# EAGLE design RoboWatch V1 Arduino (EAGLE 9.6.2)
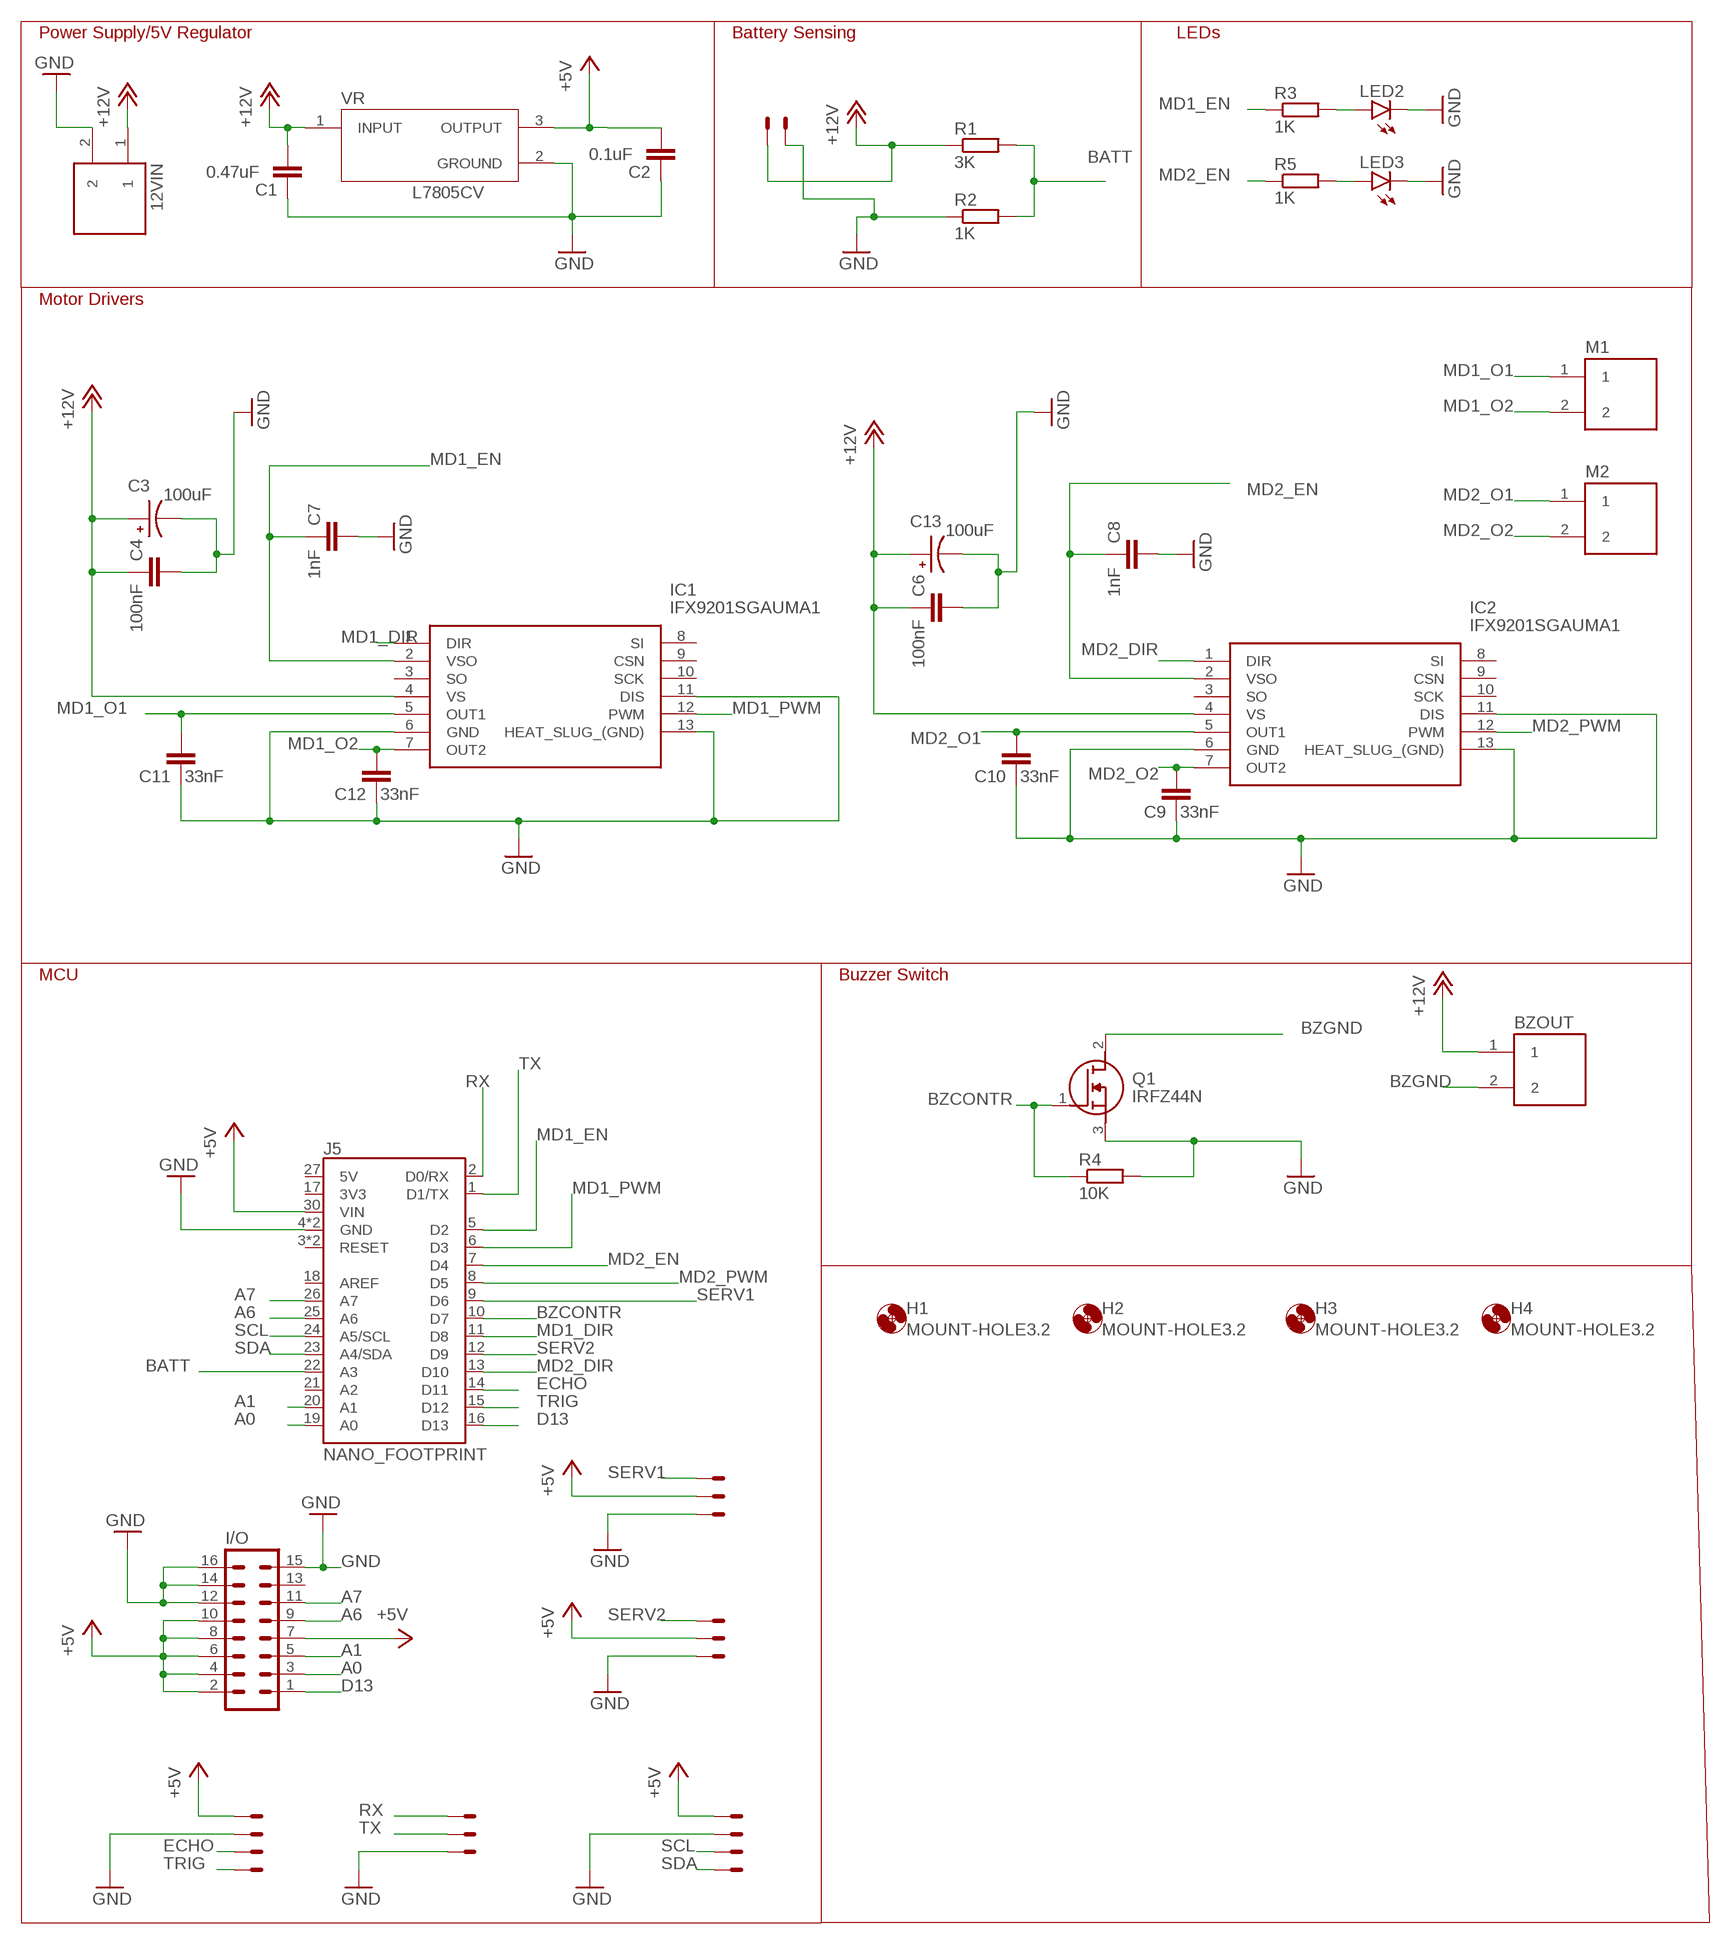
[diagram p0: schematic, sheet 1]

## Parts
12VIN  KF301-2P  [HANDSON_KF301-2P]
BZOUT  KF301-2P  [HANDSON_KF301-2P]
C1  0.47uF  C-EUC0603  [C0603]
C2  0.1uF  C-EUC0603  [C0603]
C3  100uF  EEEFN1E101UP  [CAP_EEEFN1E101UP]
C4  100nF  C-EUC0603  [C0603]
C6  100nF  C-EUC0603  [C0603]
C7  1nF  C-EUC0603  [C0603]
C8  1nF  C-EUC0603  [C0603]
C9  33nF  C-EUC0603  [C0603]
C10  33nF  C-EUC0603  [C0603]
C11  33nF  C-EUC0603  [C0603]
C12  33nF  C-EUC0603  [C0603]
C13  100uF  EEEFN1E101UP  [CAP_EEEFN1E101UP]
H1  MOUNT-HOLE3.2  [3,2]
H2  MOUNT-HOLE3.2  [3,2]
H3  MOUNT-HOLE3.2  [3,2]
H4  MOUNT-HOLE3.2  [3,2]
I2C  22-23-2041  [22-23-2041]
I/O  MA08-2  [MA08-2]
IC1  IFX9201SGAUMA1  [PG-DSO-12-17]
IC2  IFX9201SGAUMA1  [PG-DSO-12-17]
J5  NANO_FOOTPRINT  [NANO]
LED2  LEDCHIPLED_0805  [CHIPLED_0805]
LED3  LEDCHIPLED_0805  [CHIPLED_0805]
M1  KF301-2P  [HANDSON_KF301-2P]
M2  KF301-2P  [HANDSON_KF301-2P]
Q1  IRFZ44N  [TO254P440X1000X1900-3P]
R1  3K  R-EU_R0603  [R0603]
R2  1K  R-EU_R0603  [R0603]
R3  1K  R-EU_R0603  [R0603]
R4  10K  R-EU_R0603  [R0603]
R5  1K  R-EU_R0603  [R0603]
RX/TX  22-23-2031  [22-23-2031]
S1  22-23-2031  [22-23-2031]
S2  22-23-2031  [22-23-2031]
US  22-23-2041  [22-23-2041]
VR  L7805CV  [TO255P1040X460X1968-3]
X4  22-23-2021  [22-23-2021]

## Nets
+5V: C2.2 I2C.1 I/O.2 I/O.4 I/O.6 I/O.7 I/O.8 I/O.10 J5.30(VIN) S1.2 S2.2 US.1 VR.3(OUTPUT)
+12V: 12VIN.1 BZOUT.1 C1.2 C3.1 C4.1 C6.1 C13.1 IC1.4(VS) IC2.4(VS) R1.1 VR.1(INPUT) X4.1
A0: I/O.3 J5.19(A0)
A1: I/O.5 J5.20(A1)
A6: I/O.9 J5.25(A6)
A7: I/O.11 J5.26(A7)
BATT: J5.22(A3) R1.2 R2.2
BZCONTR: J5.10(D7) Q1.1(G) R4.1
BZGND: BZOUT.2 Q1.2(D)
D13: I/O.1 J5.16(D13)
ECHO: J5.14(D11) US.3
GND: 12VIN.2 C1.1 C2.1 C3.2 C4.2 C6.2 C7.2 C8.2 C9.1 C10.1 C11.1 C12.1 C13.2 I2C.2 I/O.12 I/O.14 I/O.15 I/O.16 IC1.6(GND) IC1.11(DIS) IC1.13(HEAT_SLUG_(GND)) IC2.6(GND) IC2.11(DIS) IC2.13(HEAT_SLUG_(GND)) J5.4(GND) J5.29(GND) LED2.C LED3.C Q1.3(S) R2.1 R4.2 RX/TX.3 S1.3 S2.3 US.2 VR.2(GROUND) X4.2
MD1_DIR: IC1.1(DIR) J5.11(D8)
MD1_EN: C7.1 IC1.2(VSO) J5.5(D2) R3.1
MD1_O1: C11.2 IC1.5(OUT1) M1.1
MD1_O2: C12.2 IC1.7(OUT2) M1.2
MD1_PWM: IC1.12(PWM) J5.6(D3)
MD2_DIR: IC2.1(DIR) J5.13(D10)
MD2_EN: C8.1 IC2.2(VSO) J5.7(D4) R5.1
MD2_O1: C10.2 IC2.5(OUT1) M2.1
MD2_O2: C9.2 IC2.7(OUT2) M2.2
MD2_PWM: IC2.12(PWM) J5.8(D5)
N$1: LED2.A R3.2
N$2: LED3.A R5.2
RX: J5.2(D0/RX) RX/TX.1
SCL: I2C.3 J5.24(A5/SCL)
SDA: I2C.4 J5.23(A4/SDA)
SERV1: J5.9(D6) S1.1
SERV2: J5.12(D9) S2.1
TRIG: J5.15(D12) US.4
TX: J5.1(D1/TX) RX/TX.2
Unconnected: I/O.13 IC1.3(SO) IC1.8(SI) IC1.9(CSN) IC1.10(SCK) IC2.3(SO) IC2.8(SI) IC2.9(CSN) IC2.10(SCK) J5.3(RESET) J5.17(3V3) J5.18(AREF) J5.21(A2) J5.27(5V) J5.28(RESET)

## Notes on the sheet
- Power Supply/5V Regulator | Battery Sensing | LEDs
- Motor Drivers
- MCU | Buzzer Switch

## Library data of the parts
12VIN BZOUT M1 M2 = KF301-2P:KF301-2P: 2 Pin Terminal Block 5mm Pitch Check availability <https://pricing.snapeda.com/parts/KF301-2P/Handson%20Technology/view-part?ref=eda>; AVAILABILITY: Not in stock; DESCRIPTION: 2 Pin Terminal Block 5mm Pitch; MF: Handson Technology; MP: KF301-2P; PACKAGE: None; PRICE: None
C1 C2 C4 C6-C12 = rcl:C-EU: CAPACITOR, European symbol; SPICEPREFIX: C
C3 C13 = Capstone_CAP:EEEFN1E101UP: Check availability <https://pricing.snapeda.com/parts/EEEFN1E101UP/Panasonic/view-part?ref=eda>; AVAILABILITY: In Stock; DESCRIPTION: CAP ALUM 100UF 20% 25V SMD; MF: Panasonic; MP: EEEFN1E101UP; PACKAGE: RADIAL-2 Panasonic; PRICE: None; PURCHASE-URL: https://pricing.snapeda.com/search?q=EEEFN1E101UP&ref=eda
H1-H4 = holes:MOUNT-HOLE: MOUNTING HOLE with drill center marker
I2C US = con-molex:22-23-2041: .100" (2.54mm) Center Header - 4 Pin; MF: MOLEX; MPN: 22-23-2041; OC_FARNELL: 1462920; OC_NEWARK: 38C0355
I/O = con-lstb:MA08-2: PIN HEADER; OC_FARNELL: unknown; OC_NEWARK: unknown
IC1 IC2 = IFX9201SGAUMA1:IFX9201SGAUMA1: INFINEON - IFX9201SGAUMA1 - MOTOR CONTROLLER, HALF BRIDGE, SOIC-12 Source: Datasheet <https://www.infineon.com/dgdl/Infineon-IFX9201SG-DS-v01_01-EN.pdf?fileId=5546d4624cb7f111014d2e8916795dea>; ARROW_PART_NUMBER: IFX9201SGAUMA1; ARROW_PRICE-STOCK: https://www.arrow.com/en/products/ifx9201sgauma1/infineon-technologies-ag?region=nac; DESCRIPTION: INFINEON - IFX9201SGAUMA1 - MOTOR CONTROLLER, HALF BRIDGE, SOIC-12; HEIGHT: 2.6mm; MANUFACTURER_NAME: Infineon; MANUFACTURER_PART_NUMBER: IFX9201SGAUMA1; MOUSER_PART_NUMBER: 726-IFX9201SGAUMA1; MOUSER_PRICE-STOCK: https://www.mouser.co.uk/ProductDetail/Infineon-Technologies/IFX9201SGAUMA1?qs=CVaTMblcXggE9XQ1VnAvKA%3D%3D
J5 = SparkFun-Boards:NANO_FOOTPRINT: Generic Nano Footprint
LED2 LED3 = led:LED: LED OSRAM: - CHIPLED LG R971, LG N971, LY N971, LG Q971, LY Q971, LO R971, LY R971 LH N974, LH R974 LS Q976, LO Q976, LY Q976 LO Q996 - Hyper CHIPLED LW Q18S LB Q993, LB Q99A, LB R99A - SideLED LS A670, LO A670, LY A670, LG A670, LP A670 LB A673, LV A673, LT A673, LW A673 LH A674 LY A675 LS A676, LA A676, LO A676, LY A676, LW A676 LS A679, LY A679, LG A679 - Hyper Micro SIDELED® LS Y876, LA Y876, LO Y876, LY Y876 LT Y87S - SmartLED LW L88C, LW L88S LB L89C, LB L89S, LG L890 LS L89K, LO L89K, LY L89K LS L896, LA L896, LO L896, LY L896 - TOPLED LS T670, LO T670, LY T670, LG T670, LP T670 LSG T670, LSP T670, LSY T670, LOP T670, LYG T670 LG T671, LOG T671, LSG T671 LB T673, LV T673, LT T673, LW T673 LH T674 LS T676, LA T676, LO T676, LY T676, LB T676, LH T676, LSB T676, LW T676 LB T67C, LV T67C, LT T67C, LS T67K, LO T67K, LY T67K, LW E67C LS E67B, LA E67B, LO E67B, LY E67B, LB E67C, LV E67C, LT E67C LW T67C LS T679, LY T679, LG T679 LS T770, LO T770, LY T770, LG T770, LP T770 LB T773, LV T773, LT T773, LW T773 LH T774 LS E675, LA E675, LY E675, LS T675 LS T776, LA T776, LO T776, LY T776, LB T776 LHGB T686 LT T68C, LB T68C - Hyper Mini TOPLED® LB M676 - Mini TOPLED Santana® LG M470 LS M47K, LO M47K, LY M47K Source: http://www.osram.convergy.de LUXEON: - LUMILED® LXK2-PW12-R00, LXK2-PW12-S00, LXK2-PW14-U00, LXK2-PW14-V00 LXK2-PM12-R00, LXK2-PM12-S00, LXK2-PM14-U00 LXK2-PE12-Q00, LXK2-PE12-R00, LXK2-PE12-S00, LXK2-PE14-T00, LXK2-PE14-U00 LXK2-PB12-K00, LXK2-PB12-L00, LXK2-PB12-M00, LXK2-PB14-N00, LXK2-PB14-P00, LXK2-PB14-Q00 LXK2-PR12-L00, LXK2-PR12-M00, LXK2-PR14-Q00, LXK2-PR14-R00 LXK2-PD12-Q00, LXK2-PD12-R00, LXK2-PD12-S00 LXK2-PH12-R00, LXK2-PH12-S00 LXK2-PL12-P00, LXK2-PL12-Q00, LXK2-PL12-R00 Source: www.luxeon.com KINGBRIGHT: KA-3528ASYC Source: www.kingbright.com
Q1 = CS_IRFZ44N:IRFZ44N: isc N-Channel MOSFET Transistor Source: Datasheet <https://4donline.ihs.com/images/VipMasterIC/IC/INSE/INSES02201/INSES02201-1.pdf?hkey=EF798316E3902B6ED9A73243A3159BB0>; DESCRIPTION: isc N-Channel MOSFET Transistor; HEIGHT: 4.4mm; MANUFACTURER_NAME: Inchange Semiconductor; MANUFACTURER_PART_NUMBER: IRFZ44N
R1-R5 = rcl:R-EU_: RESISTOR, European symbol; SPICEPREFIX: R
RX/TX S1 S2 = con-molex:22-23-2031: .100" (2.54mm) Center Header - 3 Pin; MF: MOLEX; MPN: 22-23-2031; OC_FARNELL: 1462950; OC_NEWARK: 30C0862
VR = Capstone_L7805CV:L7805CV: Standard Regulator Pos 5V 1.5A 3-Pin(3+Tab) TO-220 Standard Regulator Pos 5V 1.5A 3-Pin(3+Tab) TO-220 Check availability <https://pricing.snapeda.com/parts/L7805CV/STMicroelectronics/view-part?ref=eda>; AVAILABILITY: In Stock; DESCRIPTION: Linear Voltage Regulator IC Positive Fixed 1 Output 1.5A TO-220; MF: STMicroelectronics; MP: L7805CV; PACKAGE: TO-220-3 STMicroelectronics; PRICE: None; PURCHASE-URL: https://pricing.snapeda.com/search?q=L7805CV&ref=eda
X4 = con-molex:22-23-2021: .100" (2.54mm) Center Header - 2 Pin; MF: MOLEX; MPN: 22-23-2021; OC_FARNELL: 1462926; OC_NEWARK: 25C3832

## Board
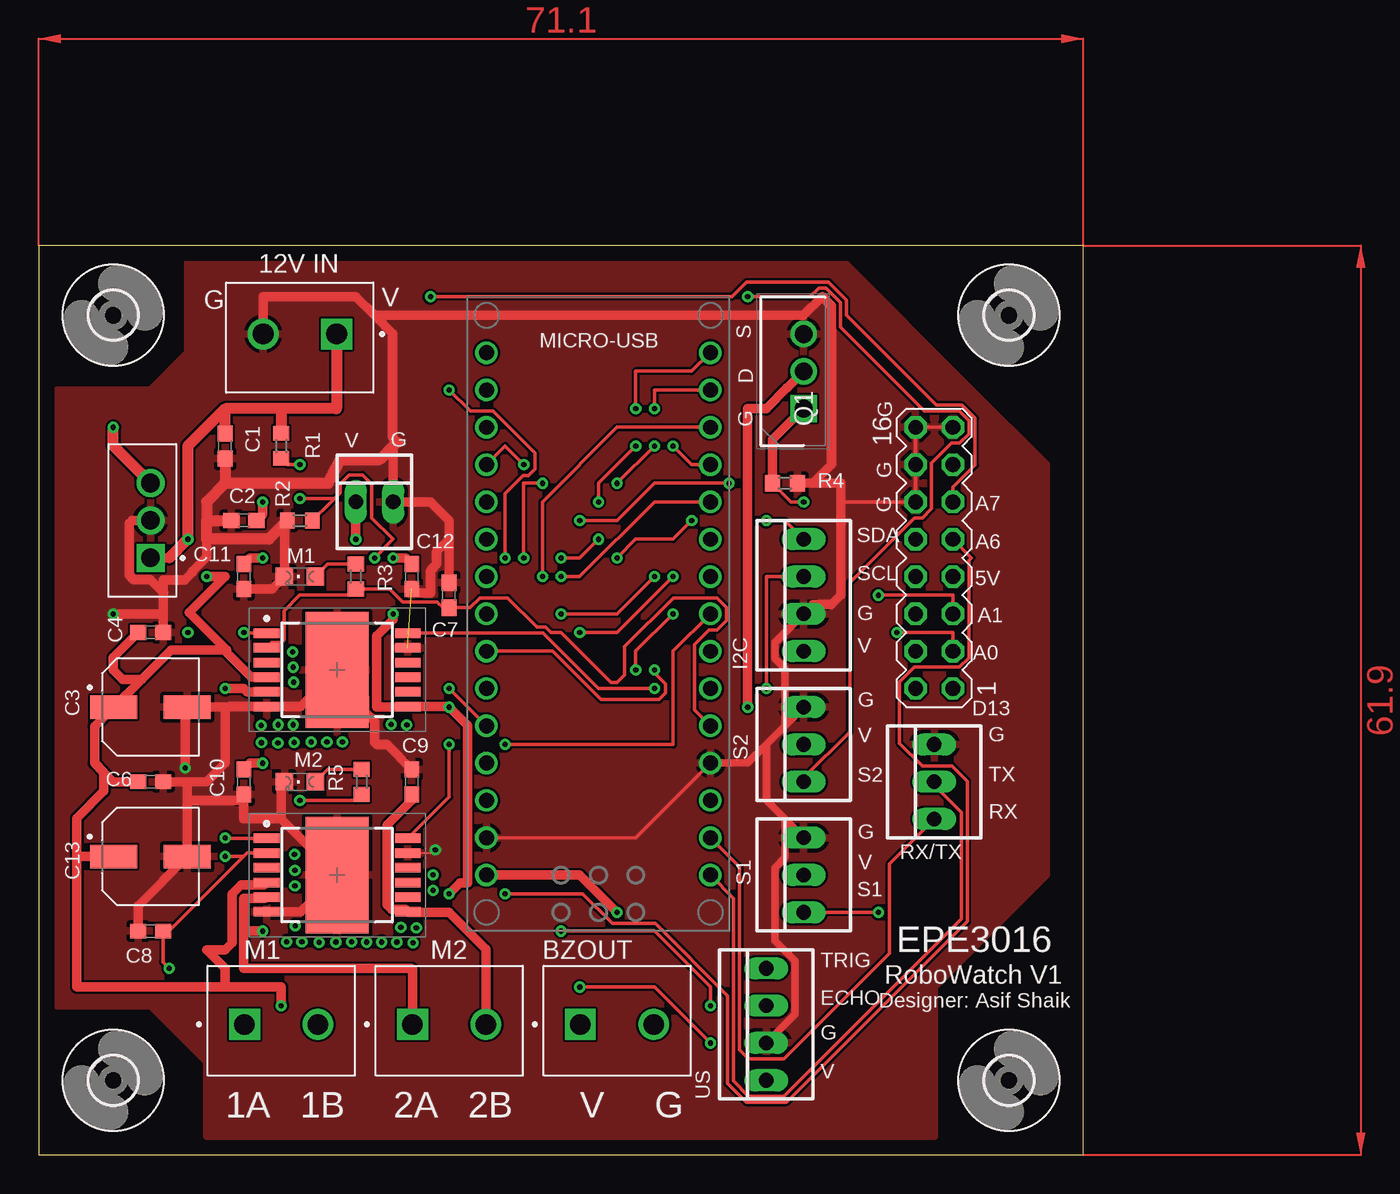
[diagram p1: board, top side]
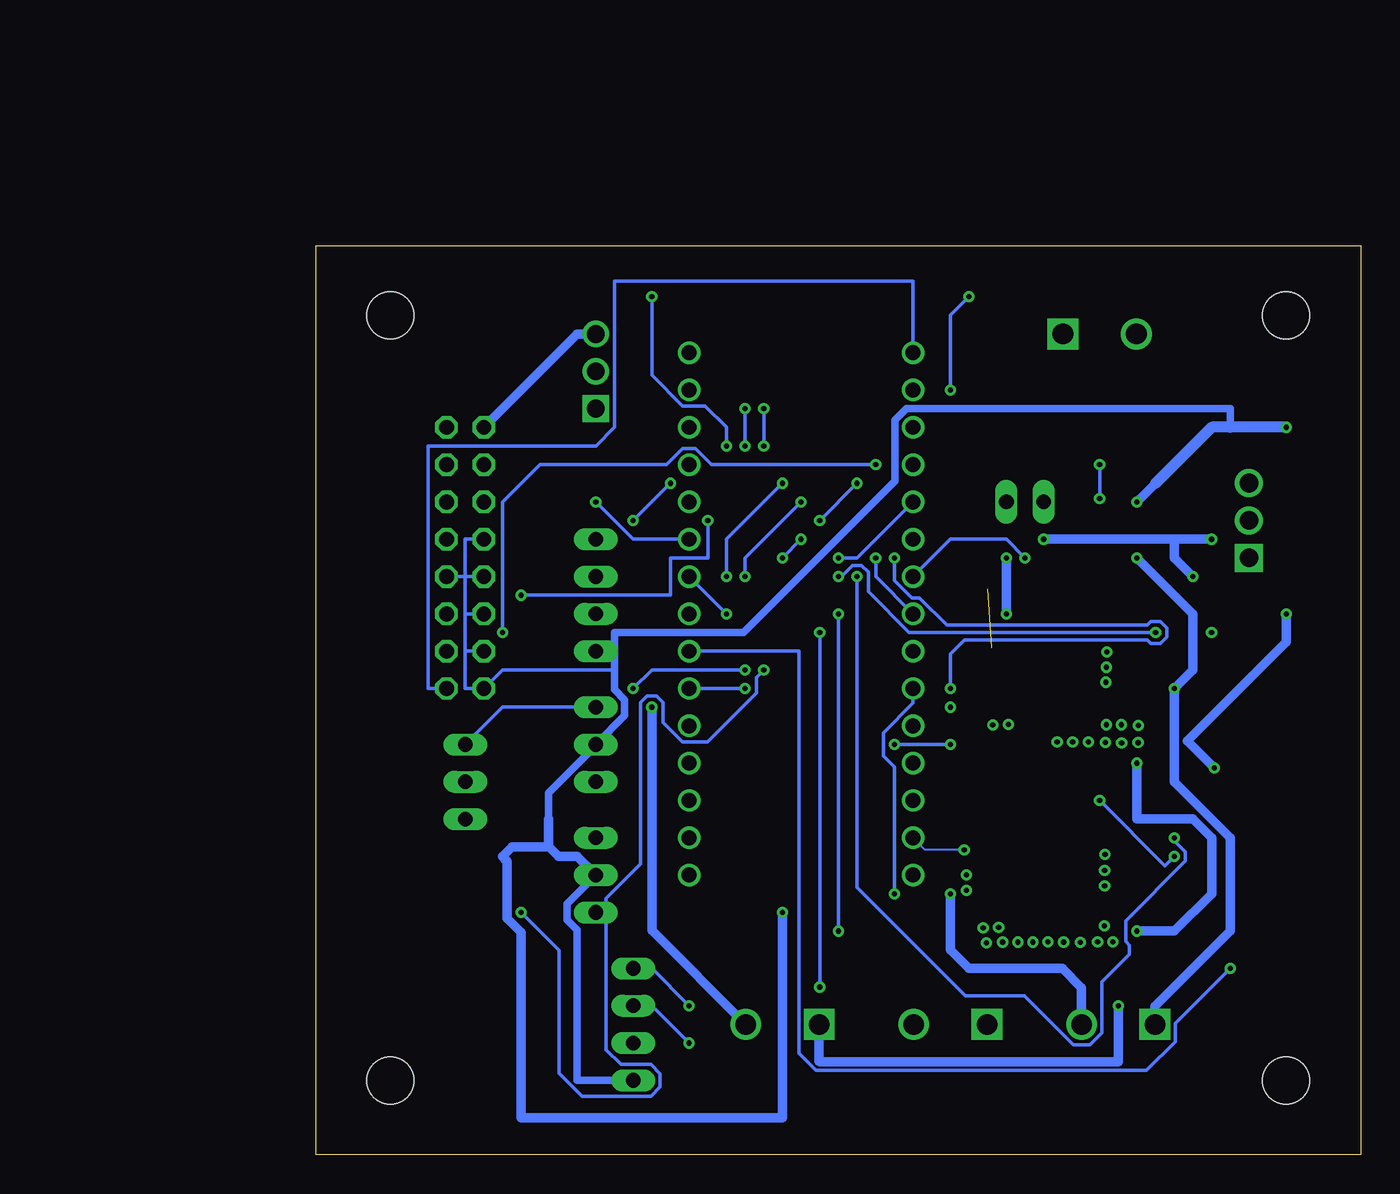
[diagram p2: board, bottom side, seen from below]

Size 71.1 x 61.9 mm. Coordinates in mm from the lower left corner, seen from the top.
Outline: 0,0 71.1,0 71.1,61.9 0,61.9 0,0
Copper layers (1*16): Top 0.035mm / dielectric 1.5mm / Bottom 0.035mm
Design rules "default *": minimum track width 6mil, minimum drill 0.35mm, track to track 6mil, track to pad 0.2mm, pad to pad 6mil, via to via 10mil, smd to smd 6mil, copper to edge 40mil, drill to drill 6mil, minimum pad ring 10mil, minimum via ring 8mil, stop-mask expansion 4mil, vias tented up to drill 0mil, thermal gap 10mil

### Footprints (pad centres in the part's own frame; a part is rotated, then mirrored left to right if it is on the bottom)
HANDSON_KF301-2P = drill 1.4 square: 1 -2.5,0 | drill 1.4: 2 2.5,0
C0603 = smd 1.1 x 1: 1 -0.85,0; 2 0.85,0
CAP_EEEFN1E101UP = smd 3.2 x 1.6: 1 -2.5,0; 2 2.5,0
3,2 = hole 3.2: 0,0
22-23-2041 = drill 1 long: 1 -3.81,0; 2 -1.27,0; 3 1.27,0; 4 3.81,0
MA08-2 = drill 1.016 octagon: 1 -8.89,-1.27; 2 -8.89,1.27; 3 -6.35,-1.27; 4 -6.35,1.27; 5 -3.81,-1.27; 6 -3.81,1.27; 7 -1.27,-1.27; 8 -1.27,1.27; 9 1.27,-1.27; 10 1.27,1.27; 11 3.81,-1.27; 12 3.81,1.27; 13 6.35,-1.27; 14 6.35,1.27; 15 8.89,-1.27; 16 8.89,1.27
PG-DSO-12-17 = smd 1.75 x 0.65: 1 -4.8,2.5; 2 -4.8,1.5; 3 -4.8,0.5; 4 -4.8,-0.5; 5 -4.8,-1.5; 6 -4.8,-2.5; 7 4.8,-2.5; 8 4.8,-1.5; 9 4.8,-0.5; 10 4.8,0.5; 11 4.8,1.5; 12 4.8,2.5 | smd 4.3 x 7.9: 13 0,0
NANO = drill 1.016: 1 -7.62,17.78; 2 -7.62,15.24; 3 -7.62,12.7; 4 -7.62,10.16; 5 -7.62,7.62; 6 -7.62,5.08; 7 -7.62,2.54; 8 -7.62,0; 9 -7.62,-2.54; 10 -7.62,-5.08; 11 -7.62,-7.62; 12 -7.62,-10.16; 13 -7.62,-12.7; 14 -7.62,-15.24; 15 -7.62,-17.78; 16 7.62,-17.78; 17 7.62,-15.24; 18 7.62,-12.7; 19 7.62,-10.16; 20 7.62,-7.62; 21 7.62,-5.08; 22 7.62,-2.54; 23 7.62,0; 24 7.62,2.54; 25 7.62,5.08; 26 7.62,7.62; 27 7.62,10.16; 28 7.62,12.7; 29 7.62,15.24; 30 7.62,17.78
CHIPLED_0805 = smd 1.2 x 1.2: A 0,-1.05; C 0,1.05
TO254P440X1000X1900-3P = drill 1.21 pad 1.815 square: 1 0,0 | drill 1.21 pad 1.815: 2 2.54,0; 3 5.08,0
R0603 = smd 1 x 1.1: 1 -0.85,0; 2 0.85,0
22-23-2031 = drill 1 long: 1 -2.54,0; 2 0,0; 3 2.54,0
TO255P1040X460X1968-3 = drill 1.27 pad 1.91 square: 1 0,0 | drill 1.27 pad 1.91: 2 2.55,0; 3 5.1,0
22-23-2021 = drill 1 long: 1 -1.27,0; 2 1.27,0

### Placement (x,y rotation side)
12VIN  17.78,55.88 180 top
BZOUT  39.37,8.89 0 top
C1  12.7,48.26 90 top
C2  13.97,43.18 0 top
C3  7.62,30.48 0 top
C4  7.62,35.56 0 top
C6  7.62,25.4 0 top
C7  27.94,38.1 90 top
C8  7.62,15.24 180 top
C9  25.4,25.4 270 top
C10  13.97,25.4 90 top
C11  13.97,39.37 90 top
C12  25.4,39.37 90 top
C13  7.62,20.32 0 top
H1  5.08,5.08 0 top
H2  66.04,57.15 0 top
H3  66.04,5.08 0 top
H4  5.08,57.15 0 top
I2C  52.07,38.1 90 top
I/O  60.96,40.64 90 top
IC1  20.32,33.02 0 top
IC2  20.32,19.05 0 top
J5  38.1,36.83 180 top
LED2  17.78,39.37 90 top
LED3  17.78,25.4 90 top
M1  16.51,8.89 0 top
M2  27.94,8.89 0 top
Q1  52.07,50.8 90 top
R1  16.51,48.26 270 top
R2  17.78,43.18 0 top
R3  21.59,39.37 90 top
R4  50.8,45.72 0 top
R5  21.98,25.39 90 top
RX/TX  60.96,25.4 90 top
S1  52.07,19.05 90 top
S2  52.07,27.94 90 top
US  49.53,8.89 90 top
VR  7.62,40.64 90 top
X4  22.86,44.45 0 top

### Tracks (layer width: path | path; a pad name or v marks a point on that pad's centre or on a via)
+5V  (via drill 0.35)
  Top 0.635: C2.2 15.24,43.6 v15.24,44.45 | J5.30 36.83,19.05 v39.37,16.51
  Top 0.762: VR.3 5.08,48.28 v5.08,49.53
  Bottom 0.254: 50.8,33.02 58.42,33.02 I/O.2 60.96,31.75 60.96,34.29 | 60.96,34.29 60.96,36.83 | 60.96,36.83 60.96,39.37 | 60.96,39.37 60.96,41.91 I/O.10 | I/O.4 60.96,34.29 | I/O.6 60.96,36.83 | I/O.8 60.96,39.37 | 60.96,39.37 I/O.7
  Bottom 0.508: 8.89,49.53 8.89,50.8 30.93,50.8 31.7,50.03 31.7,45.88 42.02,35.56 50.8,35.56 50.8,34.29 | 50.8,34.29 50.8,33.02 50.8,31.67 50.11,30.98 50.11,29.9 S2.2 52.07,27.86 55.3,24.63 55.3,22.86 | S1.2 54.03,17.09 54.03,16.01 53.34,15.32 53.34,5.08 US.1 | I2C.1 50.8,34.29
  Bottom 0.635: 13.97,45.72 v15.24,44.45 | v39.37,16.51 39.37,2.54 57.15,2.54 57.15,15.17 58.1,16.12 58.1,20 58.42,20.32 57.78,20.96 55.3,20.96 | S1.2 53.34,20.32 53.35,20.32 54.61,20.32 55.24,20.96 55.3,20.96 | 55.3,22.86 55.3,20.96
  Bottom 0.762: v5.08,49.53 8.89,49.53 10.16,49.53 13.97,45.72
+12V  (via drill 0.35)
  Top 0.635: v11.43,39.37 12.7,39.37 10.25,36.92 12.79,34.38 12.7,34.38 | 7,32.37 C3.1 3.81,29.17 3.81,26.67 4.45,26.04 | 7,32.37 9.02,34.38 12.7,34.38 | IC1.4 14.47,32.52 12.7,34.29 12.7,34.38 | X4.1 v21.59,41.91 | C6.1 5.08,25.4 4.45,26.04 | 4.45,26.04 4.45,24.77 2.6,22.92 2.6,20.32 | 2.6,20.32 2.6,11.43 12.7,11.43 | IC2.4 15.36,18.39 13.79,18.39 13.18,17.79 13.18,14.45 12.7,13.97 11.43,13.97 12.7,12.7 12.7,11.43 | 12.7,11.43 16.51,11.43 v16.51,10.16 | VR.1 8.89,40.64 | C4.1 5.08,33.87 5.08,33.02 5.73,32.37 7,32.37 | C13.1 2.6,20.32
  Top 0.762: 12VIN.1 20.28,50.8 16.51,50.8 | 16.51,50.8 12.7,50.8 | 12.7,50.8 10.16,48.26 v10.16,41.91 8.89,40.64 | C1.2 12.7,50.8 | 16.51,50.8 R1.1
  Bottom 0.635: v11.43,39.37 12.7,40.64 12.7,41.91 v10.16,41.91 v21.59,41.91 | v16.51,10.16 16.51,6.35 36.83,6.35 36.87,6.39 BZOUT.1
A0  (via drill 0.35)
  Top 0.254: J5.19 31.75,48.26 v33.02,46.99 | v58.42,35.56 62.23,35.56 I/O.3
  Bottom 0.254: v33.02,46.99 44.18,46.99 45.27,48.08 46.17,48.08 47.26,46.99 55.88,46.99 58.42,44.45 v58.42,35.56
A1  (via drill 0.35)
  Top 0.254: I/O.5 62.23,38.1 v57.15,38.1 | v44.45,43.18 43.18,41.91 40.64,41.91 v39.37,40.64 | v38.1,41.91 36.83,40.64 v35.56,40.64
  Bottom 0.254: v57.15,38.1 46.99,38.1 46.99,40.64 44.45,40.64 v44.45,43.18 | v39.37,40.64 v38.1,41.91 | v35.56,40.64 34.29,40.64 J5.20
A6  (via drill 0.35)
  Top 0.254: v31.75,17.78 37.03,17.78 39.06,15.75 41.97,15.75 46.88,10.84 46.88,4.87 48.16,3.59 50.9,3.59 63.2,15.89 63.2,25.44 62.16,26.48 60.14,26.48 58.6,28.02 58.6,32.2 59.6,33.2 62.68,33.2 63.32,33.84 63.32,40.46 63.5,40.64 I/O.9
  Bottom 0.254: J5.25 30.48,30.75 32.51,28.72 32.51,27.16 31.75,26.4 v31.75,17.78
A7  (via drill 0.35)
  Top 0.254: I/O.11 62.23,45.45 63.73,46.95 63.73,50.15 62.85,51.02 61.1,51.02 54.98,57.15 54.98,58.2 53.76,59.42 48.19,59.42 47.19,58.42 v26.67,58.42 | v27.94,52.07 29.39,50.62 30.93,50.62 33.78,47.77 33.78,46.68 33.33,46.23 32.96,46.23 31.75,45.02 v31.75,40.64 | v27.94,31.75 J5.26
  Bottom 0.254: v26.67,58.42 27.94,57.15 v27.94,52.07 | v31.75,40.64 31.75,39.1 30.57,37.92 30.03,37.92 28.18,36.07 14.53,36.07 14.28,36.32 13.66,36.32 13.21,35.87 13.21,35.25 13.66,34.8 14.28,34.8 14.53,35.05 26.98,35.05 27.94,34.09 v27.94,31.75
BATT  (via drill 0.35)
  Top 0.254: R1.2 16.93,46.99 v17.78,46.99 | R2.2 19.9,44.45 20.13,44.68 | 20.13,44.68 20.51,45.06 20.51,45.65 21.14,46.29 22.04,46.29 22.67,45.65 22.67,43.37 24.13,41.91 v22.86,40.64 | v17.78,44.68 20.13,44.68
  Bottom 0.254: v17.78,46.99 v17.78,44.68 | v22.86,40.64 24.13,41.91 27.94,41.91 J5.22
BZCONTR  (via drill 0.35)
  Top 0.254: R4.1 51.22,44.45 v52.07,44.45
  Top 0.635: R4.1 49.95,48.68 Q1.1
  Bottom 0.254: J5.10 49.53,41.91 v52.07,44.45
BZGND  (via drill 0.35)
  Top 0.635: Q1.2 50.95,52.23 49.52,50.8 48.26,50.8 v48.26,30.48
  Bottom 0.635: v48.26,30.48 48.26,15.28 BZOUT.2
D13
  Bottom 0.254: J5.16 30.48,59.49 50.8,59.49 50.8,49.53 52.07,48.26 63.5,48.26 63.5,31.75 I/O.1
ECHO  (via drill 0.35)
  Top 0.254: J5.14 41.91,52.07 v41.91,50.8 | v41.91,48.26 v39.37,45.72 | v43.18,39.37 39.37,35.56 v36.83,35.56 | v36.83,11.43 41.91,11.43 v45.72,7.62
  Bottom 0.254: v41.91,50.8 v41.91,48.26 | v39.37,45.72 43.18,41.91 v43.18,39.37 | v36.83,35.56 v36.83,11.43 | v45.72,7.62 48.26,10.16 US.3
GND  (via drill 0.35)  (1 unrouted)
  Top 0.152: IC2.11 26.77,20.55 v27,20.78
  Top 0.254: J5.4 40.64,21.59 J5.29 | 54.61,44.45 I/O.12 I/O.14 I/O.16 I/O.15
  Top 0.508: J5.4 48.26,26.67 49.53,27.94 | 49.53,27.94 50.8,29.21 | 50.8,29.21 S2.3 | 50.8,29.21 50.8,33.1 50.11,33.79 50.11,34.87 I2C.2 | 49.53,27.94 49.53,24.13 50.8,22.86 | 50.8,22.86 S1.3 | 50.8,22.86 50.8,20.24 50.11,19.55 50.11,14.58 51.49,13.2 51.49,9.58 US.2
  Top 0.635: 8.47,38.3 8.47,39.15 9.94,39.15 10.48,39.69 10.48,39.76 11.43,40.71 11.43,41.91 | 22.86,57.15 24.09,55.92 24.09,48.82 24.4,48.51 | 22.86,57.15 21.59,58.42 15.28,58.42 12VIN.2 | VR.2 6.36,43.19 6.15,42.98 6.15,39.47 6.45,39.17 7.6,39.17 8.47,38.3 | 8.47,38.3 8.5,38.28 8.47,38.25 8.47,36.83 | C11.1 15.88,38.52 LED2.C 16.73,42.98 R2.1 | 27.94,41.91 27.09,41.06 27.09,40.21 26.67,39.79 26.67,38.24 25.68,38.24 C12.1 | C7.2 27.94,41.91 | 27.94,41.91 27.94,43.18 26.67,44.45 X4.2 24.13,48.24 24.14,48.25 | C6.2 10.16,25.4 | 10.16,25.4 11.43,25.4 12.7,26.67 12.7,30.24 | 12.7,30.24 12.7,30.48 C3.2 9.98,30.34 v9.98,26.34 | 10.12,24.13 C13.2 6.77,16.97 C8.2 | 10.12,24.13 10.12,25.36 10.16,25.4 | LED3.C 16.51,25.18 16.51,22.86 | 16.51,22.86 13.97,22.86 C10.1 13.55,24.13 10.12,24.13 | IC2.6 17.82,16.55 IC2.13 16.51,22.86 | C9.1 23.71,27.94 23,27.94 22.86,28.08 22.86,29.49 22.2,30.15 22.2,31.14 IC1.13 17.82,30.52 IC1.6 12.98,30.52 12.7,30.24 | 22.86,57.15 52.07,57.15 53.34,58.42 53.98,57.79 53.98,46.99 52.7,45.72 | I2C.2 52.7,37.46 53.98,37.46 54.61,38.1 54.61,44.45 54.61,45.72 52.7,45.72 | v5.08,36.83 8.47,36.83 | 52.7,45.72 R4.2 | C4.2 8.47,36.83
  Top 0.762: C1.1 12.7,45.72 | 12.7,45.72 11.43,44.45 11.43,43.18 | 11.43,43.18 C2.1 | R2.1 15.66,41.91 11.43,41.91 11.43,43.18 | 12.7,45.72 19.72,45.72 20.57,47.35 23.24,47.35 24.14,48.25 24.4,48.51
  Bottom 0.152: v27,20.78 29.67,20.78 J5.29
  Bottom 0.254: S2.3 58.42,30.48 RX/TX.3
  Bottom 0.635: v9.98,26.34 11.82,28.18 5.08,34.93 v5.08,36.83 | Q1.3 53.34,55.88 I/O.16
  pour Top: 10.16,59.69 10.16,54.61 7.62,52.07 1.27,52.07 1.27,10.16 7.62,10.16 10.16,7.62 11.43,6.35 11.43,1.27 60.96,1.27 60.96,11.43 68.58,19.05 68.58,46.99 63.5,52.07 54.61,60.96 10.16,60.96
MD1_DIR  (via drill 0.35)
  Top 0.254: IC1.1 14.01,35.52 v13.97,35.56 | v35.56,39.37 36.83,39.37 41.91,44.45 J5.11
  Bottom 0.254: v13.97,35.56 30.75,35.56 33.53,38.34 33.53,39.68 33.98,40.13 34.6,40.13 35.36,39.37 v35.56,39.37
MD1_EN
  Top 0.254: IC1.2 15.87,34.87 16.53,34.87 16.72,35.06 16.72,37.04 17.78,38.1 21.17,38.1 R3.1 23.89,38.52 24.77,37.64 27.13,37.64 27.52,37.25 C7.1 29.36,37.25 30.03,37.92 31.93,37.92 33.92,35.93 34.5,35.93 34.87,35.56 35.56,35.56 38.96,32.16 39.37,32.16 39.88,32.67 39.88,34.6 43.2,37.92 46.17,37.92 46.81,37.28 46.81,36.38 46.17,35.74 45.63,35.74 44.63,34.74 44.63,30.3 J5.5
MD1_O1  (via drill 0.35)
  Top 0.635: IC1.5 14.2,31.52 13.97,31.75 v12.7,31.75 | C11.2 14.39,40.64 v15.24,40.64
  Bottom 0.635: v15.24,40.64 11.43,36.83 11.43,33.02 v12.7,31.75 12.7,25.4 8.89,21.59 8.89,15.24 14.01,10.12 M1.1
MD1_O2  (via drill 0.35)
  Top 0.635: v27.94,17.78 28.68,18.52 29.2,18.52 29.2,29.22 v27.94,30.48 27.9,30.52 IC1.7 25.08,30.48 22.99,30.48 22.99,35.32 24.13,36.46 v24.13,36.83 | C12.2 24.98,40.64 v24.13,40.64
  Bottom 0.635: M1.2 19.01,11.39 20.32,12.7 26.67,12.7 27.94,13.97 v27.94,17.78 | v24.13,40.64 v24.13,36.83
MD1_PWM  (via drill 0.35)
  Top 0.254: IC1.12 34.33,35.52 38.1,31.75 v41.91,31.75
  Bottom 0.254: v41.91,31.75 J5.6
MD2_DIR  (via drill 0.35)
  Top 0.254: IC2.1 12.74,21.55 v12.7,21.59 | v34.29,39.37 34.29,44.45 39.37,49.53 J5.13
  Bottom 0.254: v12.7,21.59 12.7,21.39 11.94,20.63 11.94,20.01 16,15.95 16,14.53 15.75,14.28 15.75,13.66 17.63,11.77 17.63,8.32 18.44,7.51 19.58,7.51 22.9,10.83 26.92,10.83 34.29,18.21 v34.29,39.37
MD2_EN  (via drill 0.35)
  Top 0.254: R5.1 21.58,24.13 v17.78,24.13 | IC2.2 14.2,20.55 13.97,20.32 | 13.97,20.32 8.89,15.24 C8.1 8.47,13.12 v8.89,12.7 | v12.7,20.32 13.97,20.32
  Bottom 0.254: v17.78,24.13 13.34,19.69 v12.7,20.32 | v8.89,12.7 12.63,8.96 12.63,7.71 14.58,5.75 37.08,5.75 38.25,6.92 38.25,34.29 J5.7
MD2_O1  (via drill 0.35)
  Top 0.635: C10.2 14.39,26.67 v15.24,26.67 | IC2.5 15.43,17.46 13.97,17.46 13.97,15.24 | M2.1 25.44,12.66 25.4,12.7 16.51,12.7 13.97,12.7 13.97,15.24 | 13.97,15.24 v15.24,15.24
  Bottom 0.635: v15.24,26.67 15.24,22.86 11.43,22.86 10.16,21.59 10.16,17.78 12.7,15.24 v15.24,15.24
MD2_O2
  Top 0.635: M2.2 30.44,14.01 27.94,16.51 25.16,16.51 IC2.7 24.96,16.71 24.03,16.71 23.73,17.01 23.73,22.46 25.4,24.13 C9.2
MD2_PWM  (via drill 0.35)
  Top 0.254: IC2.12 27.94,24.37 v27.94,27.94 | J5.8 43.18,34.29 43.18,27.94 v31.75,27.94
  Bottom 0.254: v27.94,27.94 v31.75,27.94
N$1
  Top 0.254: LED2.A 19.68,40.22 R3.2
N$2
  Top 0.254: LED3.A 19.67,26.24 R5.2
N$3  (via drill 0.35)
  other vias: 17.3,34.24
N$4  (via drill 0.35)
  other vias: 17.31,33.2
N$5  (via drill 0.35)
  other vias: 17.35,32.18
N$6  (via drill 0.35)
  other vias: 23.99,29.31
N$7  (via drill 0.35)
  other vias: 25.06,29.27
N$8  (via drill 0.35)
  other vias: 10.16,35.56
N$9  (via drill 0.35)
  other vias: 17.32,29.29
N$10  (via drill 0.35)
  other vias: 16.29,29.29
N$11  (via drill 0.35)
  other vias: 15.14,29.25
N$12  (via drill 0.35)
  other vias: 17.41,20.46
N$13  (via drill 0.35)
  other vias: 17.44,19.37
N$14  (via drill 0.35)
  other vias: 17.44,18.33
N$15  (via drill 0.35)
  other vias: 17.46,15.6
N$16  (via drill 0.35)
  other vias: 16.89,14.52
N$17  (via drill 0.35)
  other vias: 17.92,14.52
N$18  (via drill 0.35)
  other vias: 19.09,14.47
N$19  (via drill 0.35)
  other vias: 20.23,14.49
N$20  (via drill 0.35)
  other vias: 21.3,14.52
N$21  (via drill 0.35)
  other vias: 22.31,14.49
N$22  (via drill 0.35)
  other vias: 23.34,14.49
N$23  (via drill 0.35)
  other vias: 24.38,14.49
N$24  (via drill 0.35)
  other vias: 25.48,14.44
N$25  (via drill 0.35)
  other vias: 25.7,15.47
N$26  (via drill 0.35)
  other vias: 24.65,15.49
N$27  (via drill 0.35)
  other vias: 15.16,28.07
N$28  (via drill 0.35)
  other vias: 16.28,28.05
N$29  (via drill 0.35)
  other vias: 17.4,28.08
N$30  (via drill 0.35)
  other vias: 18.54,28.11
N$31  (via drill 0.35)
  other vias: 19.62,28.11
N$32  (via drill 0.35)
  other vias: 20.68,28.11
N$33  (via drill 0.35)
  other vias: 26.85,19.08
N$36  (via drill 0.35)
  other vias: 26.85,18.02
RX
  Top 0.254: J5.2 47.7,19.62 47.7,7.17 48.33,6.54 50.73,6.54 57.91,13.72 57.91,19.81 RX/TX.1
SCL  (via drill 0.35)
  Top 0.254: J5.24 34.98,34.29 38.28,30.99 42.22,30.99 42.67,31.44 42.67,32.06 41.91,32.82 v41.91,33.02 | v49.53,31.75 49.53,39.37 I2C.3
  Bottom 0.254: v41.91,33.02 48.26,33.02 v49.53,31.75
SDA  (via drill 0.35)
  Top 0.254: v36.83,43.18 39.37,43.18 41.91,45.72 v46.99,45.72 | v49.53,43.18 50.8,43.18 I2C.4 | v33.02,40.64 33.02,45.72 v34.29,45.72
  Bottom 0.254: J5.23 33.02,39.37 v33.02,40.64 | v46.99,45.72 v49.53,43.18 | v34.29,45.72 v36.83,43.18
SERV1  (via drill 0.35)
  Top 0.254: v43.18,36.83 40.64,34.29 v40.64,33.02 | v57.15,16.51 S1.1
  Bottom 0.254: J5.9 v43.18,36.83 | v40.64,33.02 41.15,32.51 41.15,31.44 44.46,28.12 46.17,28.12 47.5,29.45 47.5,30.79 47.95,31.24 48.57,31.24 49.02,30.79 49.02,19.82 51.37,17.47 51.37,7.17 50.35,6.16 48.33,6.16 47.7,5.53 47.7,4.63 48.33,4 53.01,4 54.56,5.55 54.56,13.93 v57.15,16.51
SERV2  (via drill 0.35)
  Top 0.254: S2.1 52.07,25.66 55.21,28.79 55.21,38.97 59.6,43.36 60.14,43.36 60.78,44 60.78,47.08 62.14,48.44 62.68,48.44 63.32,49.08 63.32,49.98 62.68,50.62 60.29,50.62 54.57,56.34 54.57,58.03 53.59,59.02 53.09,59.02 52.5,58.42 v48.26,58.42 | v43.18,48.26 44.45,46.99 J5.12
  Bottom 0.254: v48.26,58.42 48.26,53.07 46.17,50.98 44.63,50.98 43.18,49.53 v43.18,48.26
TRIG  (via drill 0.35)
  Top 0.254: J5.15 44.45,53.34 40.64,53.34 v40.64,50.8 | v40.64,48.26 38.1,45.72 v38.1,44.45 | v41.91,39.37 39.37,36.83 v35.56,36.83 | v35.56,15.24 41.91,15.24 45.72,11.43 v45.72,10.16
  Bottom 0.254: v40.64,50.8 v40.64,48.26 | v35.56,36.83 v35.56,15.24 | v45.72,10.16 48.26,12.7 US.4 | v38.1,44.45 41.91,40.64 v41.91,39.37
TX
  Top 0.254: J5.1 47.29,17.48 47.29,5.04 48.33,4 50.73,4 62.8,16.06 62.8,23.31 60.96,25.14 RX/TX.2
(copper drawn outside any net)
  shapes: Top area x2

### Text on the board
tPlace: 12V IN | G | V | 1A | 1B | 2A | 2B | V | G
tNames: S | MICRO-USB | D | G | G | V | G | G | G | A7 | A6 | M1 | SDA | 5V | SCL | A1 | G | V | A0 | G | D13 | V | G | M2 | S2 | TX | RX | G | V | S1 | EPE3016 | TRIG | RoboWatch V1 | ECHO | Designer: Asif Shaik | G | V